# Altium project bh_netlan_0_alph.PrjPcb
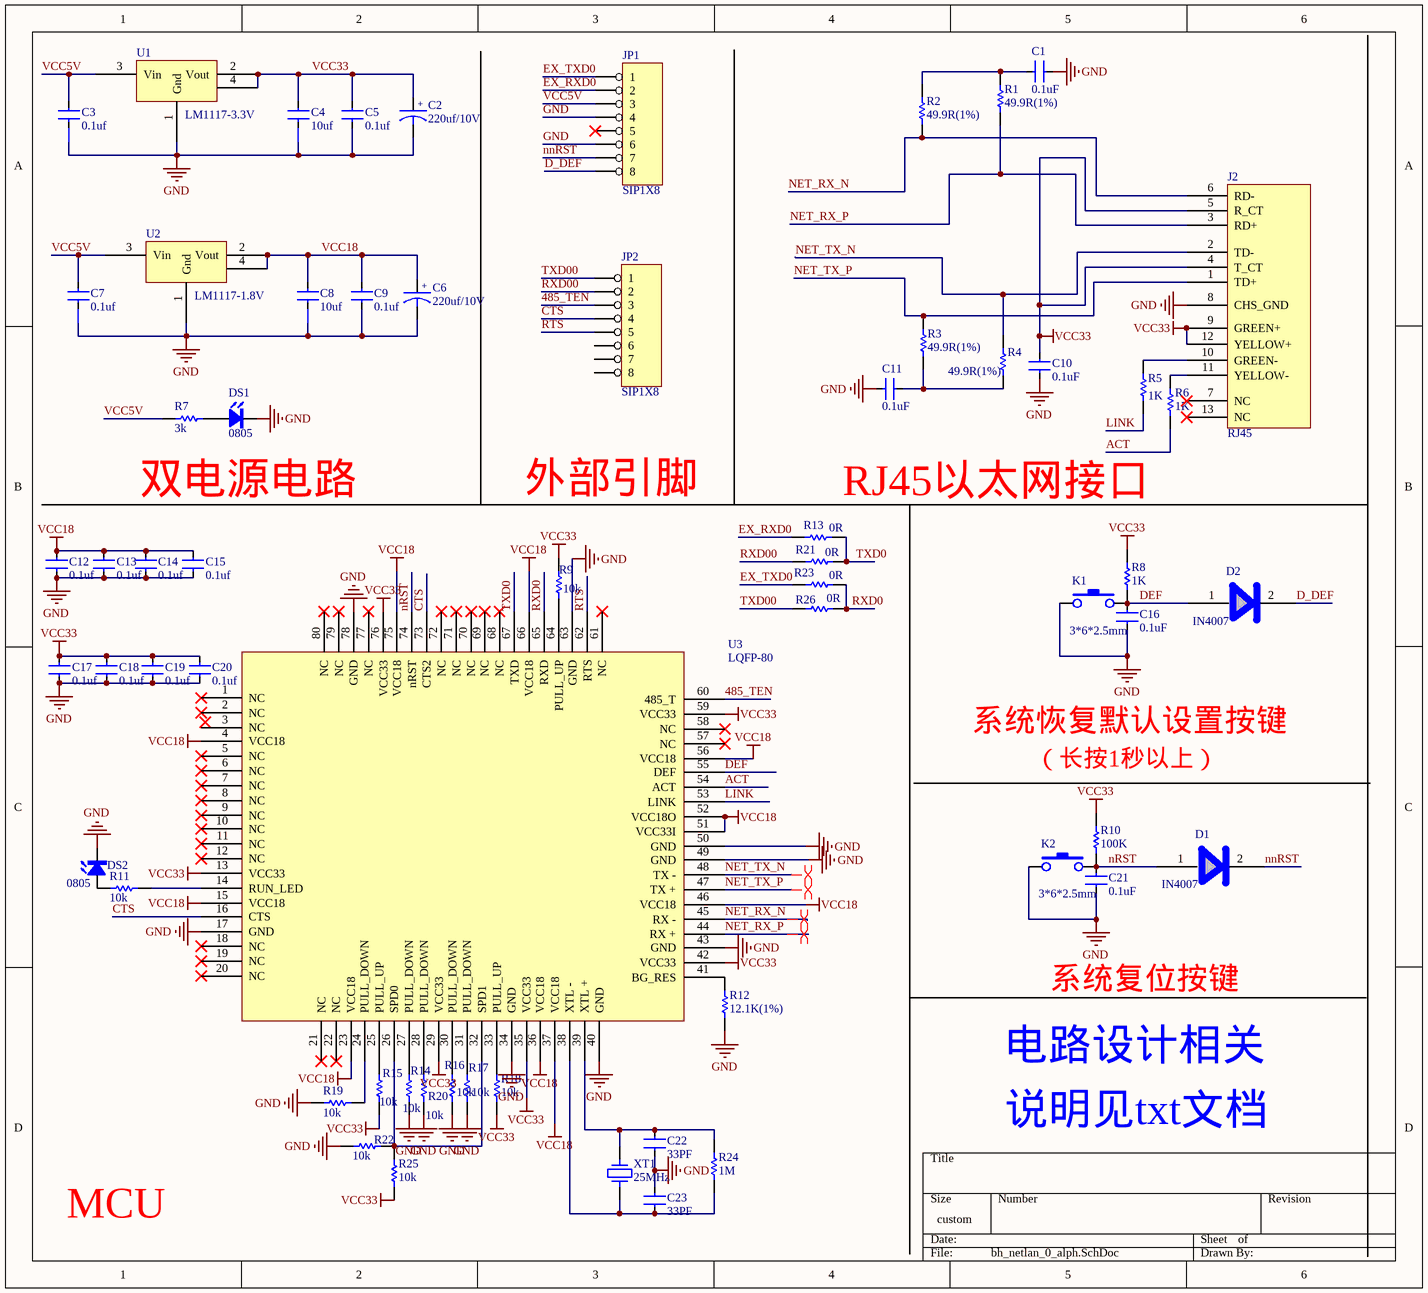
[diagram p0: bh_netlan_0_alph.SchDoc]
1 sheet, 62 parts. Net scope: global (net labels, ports and power ports of the same name join across sheets).
Board file: bh_netlan_0_alph.PcbDoc

## Sheet bh_netlan_0_alph.SchDoc
size 266 x 241 mm

### Parts
C1  value 0.1uF  [C0805]  (hidden comment: CAP-SMD)
C2  220uf/10V  [C6032]
C3  0.1uf  [C0805]
C4  10uf  [C0805]
C5  0.1uf  [C0805]
C6  220uf/10V  [C6032]
C7  0.1uf  [C0805]
C8  10uf  [C0805]
C9  0.1uf  [C0805]
C10  value 0.1uF  [C0805]  (hidden comment: CAP-SMD)
C11  value 0.1uF  [C0805]  (hidden comment: CAP-SMD)
C12  0.1uf  [C0603A]
C13  0.1uf  [C0603A]
C14  0.1uf  [C0603A]
C15  0.1uf  [C0603A]
C16  value 0.1uF  [C0805]  (hidden comment: CAP-SMD)
C17  0.1uf  [C0603A]
C18  0.1uf  [C0603A]
C19  0.1uf  [C0603A]
C20  0.1uf  [C0603A]
C21  value 0.1uF  [C0805]  (hidden comment: CAP-SMD)
C22  value 33PF  [C0603A]  (hidden comment: CAP-SMD)
C23  value 33PF  [C0603A]  (hidden comment: CAP-SMD)
D1  IN4007  [DO-214(SMA)]
D2  IN4007  [DO-214(SMA)]
DS1  0805  [LED(0805)]
DS2  0805  [LED(0805)]
J2  RJ45  [RJ45]
JP1  SIP1X8  [SIP1x8x2.54]
JP2  SIP1X8  [SIP1x8x2.54]
K1  3*6*2.5mm  [key_2pin]
K2  3*6*2.5mm  [key_2pin]
R1  value 49.9R(1%)  [R0603]  (hidden comment: R0603A)
R2  value 49.9R(1%)  [R0603]  (hidden comment: R0603A)
R3  value 49.9R(1%)  [R0603]  (hidden comment: R0603A)
R4  value 49.9R(1%)  [R0603]  (hidden comment: R0603A)
R5  value 1K  [R0603]  (hidden comment: R0603A)
R6  value 1K  [R0603]  (hidden comment: R0603A)
R7  value 3k  [R0603]  (hidden comment: R0603A)
R8  value 1K  [R0603]  (hidden comment: R0603A)
R9  value 10k  [R0603]  (hidden comment: R0603A)
R10  value 100K  [R0603]  (hidden comment: R0603A)
R11  value 10k  [R0603]  (hidden comment: R0603A)
R12  value 12.1K(1%)  [R0603]  (hidden comment: R0603A)
R13  value 0R  [R0603]  (hidden comment: R0603A)
R14  value 10k  [R0603]  (hidden comment: R0603A)
R15  value 10k  [R0603]  (hidden comment: R0603A)
R16  value 10k  [R0603]  (hidden comment: R0603A)
R17  value 10k  [R0603]  (hidden comment: R0603A)
R18  value 10k  [R0603]  (hidden comment: R0603A)
R19  value 10k  [R0603]  (hidden comment: R0603A)
R20  value 10k  [R0603]  (hidden comment: R0603A)
R21  value 0R  [R0603]  (hidden comment: R0603A)
R22  value 10k  [R0603]  (hidden comment: R0603A)
R23  value 0R  [R0603]  (hidden comment: R0603A)
R24  value 1M  [R0603]  (hidden comment: R0603A)
R25  value 10k  [R0603]  (hidden comment: R0603A)
R26  value 0R  [R0603]  (hidden comment: R0603A)
U1  LM1117-3.3V  [SOT-223]
U2  LM1117-1.8V  [SOT-223]
U3  LQFP-80  [LQFP-80]
XT1  25MHz  [XTAL/HC-49S]

### Nets
GND: C1.1 C2.2 C3.2 C4.2 C5.2 C6.2 C7.2 C8.2 C9.2 C10.1 C11.2 C12.2 C13.2 C14.2 C15.2 C16.1 C17.2 C18.2 C19.2 C20.2 C21.1 C22.1 C23.2 DS1.K DS2.K J2.8(CHS_GND) JP1.4 JP1.6 K1.1 K2.1 R12.2 R14.1 R16.1 R17.1 R19.1 R20.1 R22.2 U1.1(Gnd) U2.1(Gnd) U3.17(GND) U3.34(GND) U3.40(GND) U3.43(GND) U3.49(GND) U3.50(GND) U3.63(GND) U3.78(GND)
VCC18: C6.1 C8.1 C9.1 C12.1 C13.1 C14.1 C15.1 U2.2(Vout) U2.4 U3.4(VCC18) U3.15(VCC18) U3.23(VCC18) U3.36(VCC18) U3.37(VCC18) U3.46(VCC18) U3.51(VCC33I) U3.52(VCC18O) U3.56(VCC18) U3.66(VCC18) U3.75(VCC18)
VCC33: C2.1 C4.1 C5.1 C10.2 C17.1 C18.1 C19.1 C20.1 J2.4(T_CT) J2.5(R_CT) J2.9(GREEN+) J2.12(YELLOW+) R8.1 R9.2 R10.1 R15.1 R18.1 R25.1 U1.2(Vout) U1.4 U3.13(VCC33) U3.29(VCC33) U3.35(VCC33) U3.42(VCC33) U3.59(VCC33) U3.76(VCC33)
485_TEN: JP2.3 U3.60(485_T)
ACT: R6.2 U3.54(ACT)
CTS: JP2.4 U3.16(CTS) U3.73(CTS2)
D_DEF: D2.2 JP1.8
DEF: C16.2 D2.1 K1.2 R8.2 U3.55(DEF)
EX_RXD0: JP1.2 R13.2
EX_TXD0: JP1.1 R23.2
LINK: R5.2 U3.53(LINK)
NET_RX_N: J2.6(RD-) R2.2 U3.45(RX_-)
NET_RX_P: J2.3(RD+) R1.2 U3.44(RX_+)
NET_TX_N: J2.2(TD-) R4.1 U3.48(TX_-)
NET_TX_P: J2.1(TD+) R3.1 U3.47(TX_+)
nnRST: D1.2 JP1.7
nRST: C21.2 D1.1 K2.2 R10.2 U3.74(nRST)
RTS: JP2.5 U3.62(RTS)
RXD0: R23.1 R26.1 U3.65(RXD)
RXD00: JP2.2 R21.2
TXD0: R13.1 R21.1 U3.67(TXD)
TXD00: JP2.1 R26.2
VCC5V: C3.1 C7.1 JP1.3 R7.2 U1.3(Vin) U2.3(Vin)
NetC1_2: C1.2 R1.1 R2.1
NetC11_1: C11.1 R3.2 R4.2
NetC22_2: C22.2 R24.1 U3.39(XTL_+) XT1.2
NetC23_1: C23.1 R24.2 U3.38(XTL_-) XT1.1
NetDS1_A: DS1.A R7.1
NetDS2_A: DS2.A R11.2
NetJ2_10: J2.10(GREEN-) R5.1
NetJ2_11: J2.11(YELLOW-) R6.1
NetR9_1: R9.1 U3.64(PULL_UP)
NetR11_1: R11.1 U3.14(RUN_LED)
NetR12_1: R12.1 U3.41(BG_RES)
NetR14_2: R14.2 U3.27(PULL_DOWN)
NetR15_2: R15.2 U3.25(PULL_UP)
NetR16_2: R16.2 U3.30(PULL_DOWN)
NetR17_2: R17.2 U3.31(PULL_DOWN)
NetR18_2: R18.2 U3.33(PULL_UP)
NetR19_2: R19.2 U3.24(PULL_DOWN)
NetR20_2: R20.2 U3.28(PULL_DOWN)
NetR22_1: R22.1 R25.2 U3.26(SPD0) U3.32(SPD1)

Not connected (* = marked no-connect by the designer): J2 7(NC)* 13(NC)*; JP1 5*; JP2 6 7 8; U3 1(NC)* 2(NC)* 3(NC) 5(NC)* 6(NC)* 7(NC)* 8(NC)* 9(NC)* 10(NC)* 11(NC)* 12(NC)* 18(NC)* 19(NC)* 20(NC)* 21(NC)* 22(NC)* 57(NC)* 58(NC)* 61(NC)* 68(NC)* 69(NC)* 70(NC)* 71(NC)* 72(NC)* 77(NC)* 79(NC)* 80(NC)*

### Layout directives
differential pair: NET_RX_N, NET_RX_P, NET_TX_N, NET_TX_P

### Notes on the sheet
- 双电源电路
- 外部引脚
- (near R13) RJ45以太网接口
- 系统恢复默认设置按键
- (near R10) （长按1秒以上）
- 系统复位按键
- 电路设计相关
- 说明见txt文档
- MCU
- (in symbol CAP-T) +

### Library data of the parts
C1 C3-C5 C7-C23 = CAP-SMD: SMD-CAP
C2 C6 = CAP-T: 钽电容; Value: 220uf/10V
DS1 DS2 = LED: Value: LED
JP1 JP2 = SIP1X8: 8 Pin Header; Value: SIP1X8
K1 K2 = KEY: Value: KEY_3*6*2.5mm
R1-R26 = RES: Resistor
U1 U2 = ASM1117-2.5V
U3 = ZLAN1003: value: LQFP-80
XT1 = XT: 晶振; Value: XT
D1 D2 = IN4007: value: IN4007
J2 = RJ45: value: RJ45